# Altium project gan_power_vsi.PrjPcb
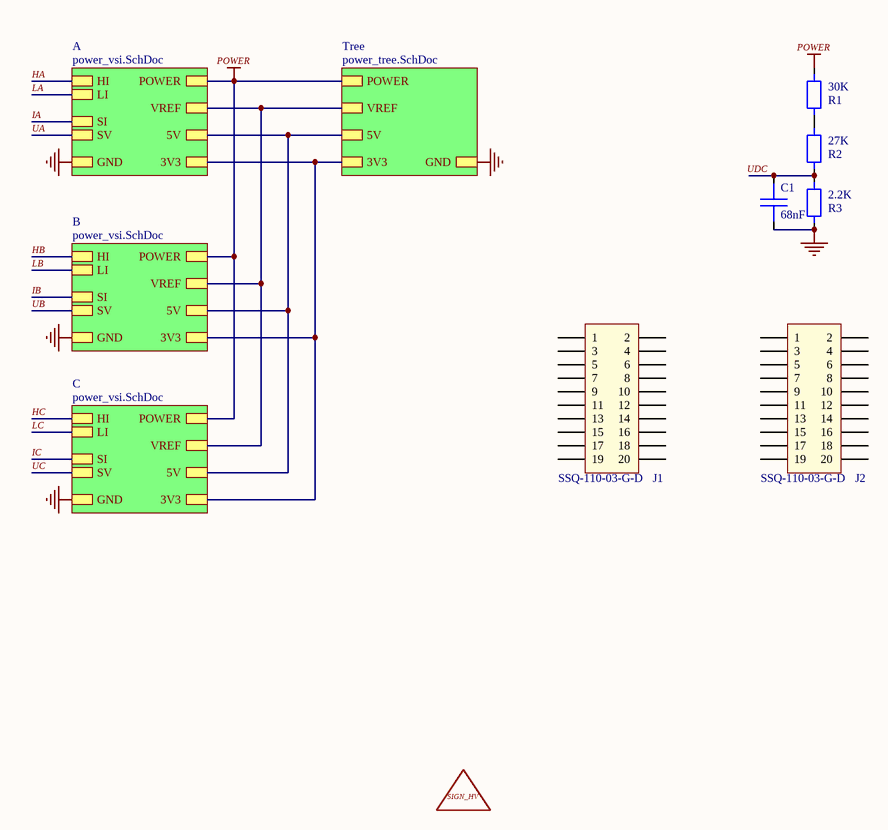
[diagram p0: power_full.SchDoc]
3 sheets, 184 parts. Net scope: hierarchical (ports join the sheet entries above them; power ports are global).
Board file: power_pcb.PcbDoc
Sheets:
  power_full.SchDoc
    A = power_vsi.SchDoc
    Tree = power_tree.SchDoc
    B = power_vsi.SchDoc
    C = power_vsi.SchDoc

## Sheet power_full.SchDoc
size A4; SheetNumber: 1; SheetTotal: 3

### Parts
C1  68nF  [C0402]
J1  SSQ-110-03-G-D  [HDR-TH_P2.5_20P-Stacking]
J2  SSQ-110-03-G-D  [HDR-TH_P2.5_20P-Stacking]
R1  30K  [R0402]
R2  27K  [R0402]
R3  2.2K  [R0402]
S1  SIGN_HV  [SIGN_HV]  (value not drawn)  (no BOM)

### Sub-sheets
A = power_vsi.SchDoc: HI, LI, SI, POWER, GND, SV, 5V, 3V3, VREF
B = power_vsi.SchDoc: HI, LI, SI, POWER, GND, SV, 5V, 3V3, VREF
C = power_vsi.SchDoc: HI, LI, SI, POWER, GND, SV, 5V, 3V3, VREF
Tree = power_tree.SchDoc: POWER, GND, 5V, 3V3, VREF

### Nets
3V3: sheet A/3V3, sheet Tree/3V3, sheet B/3V3, sheet C/3V3
5V: sheet A/5V, sheet Tree/5V, sheet B/5V, sheet C/5V
GND: C1.2 R3.2 ; sheet A/GND, sheet Tree/GND, sheet B/GND, sheet C/GND
POWER: R1.1 ; sheet A/POWER, sheet Tree/POWER, sheet B/POWER, sheet C/POWER
NetC1_1: C1.1 R2.2 R3.1
NetC15_2: sheet A/VREF, sheet Tree/VREF, sheet B/VREF, sheet C/VREF
NetR1_2: R1.2 R2.1

Not connected (* = marked no-connect by the designer): J1 10(1) 11(2) 12(3) 13(4) 14(5) 15(6) 16(7) 17(8) 18(9) 19(10) 20(11) 21(12) 22(13) 23(14) 24(15) 25(16) 26(17) 27(18) 28(19) 29(20); J2 10(1) 11(2) 12(3) 13(4) 14(5) 15(6) 16(7) 17(8) 18(9) 19(10) 20(11) 21(12) 22(13) 23(14) 24(15) 25(16) 26(17) 27(18) 28(19) 29(20)

### Notes on the sheet
- Labels drawn without touching a wire or pin: UDC

### Library data of the parts
C1 = Capacitor: 16V, 5%
J1 J2 = TH-20P
R1-R3 = Resistance: 1%

## Sheet power_vsi.SchDoc
size A4; SheetNumber: 3; SheetTotal: 3
Used 3 times, as channels A, B, C. Parts and nets are listed once, with the designators drawn on the sheet.
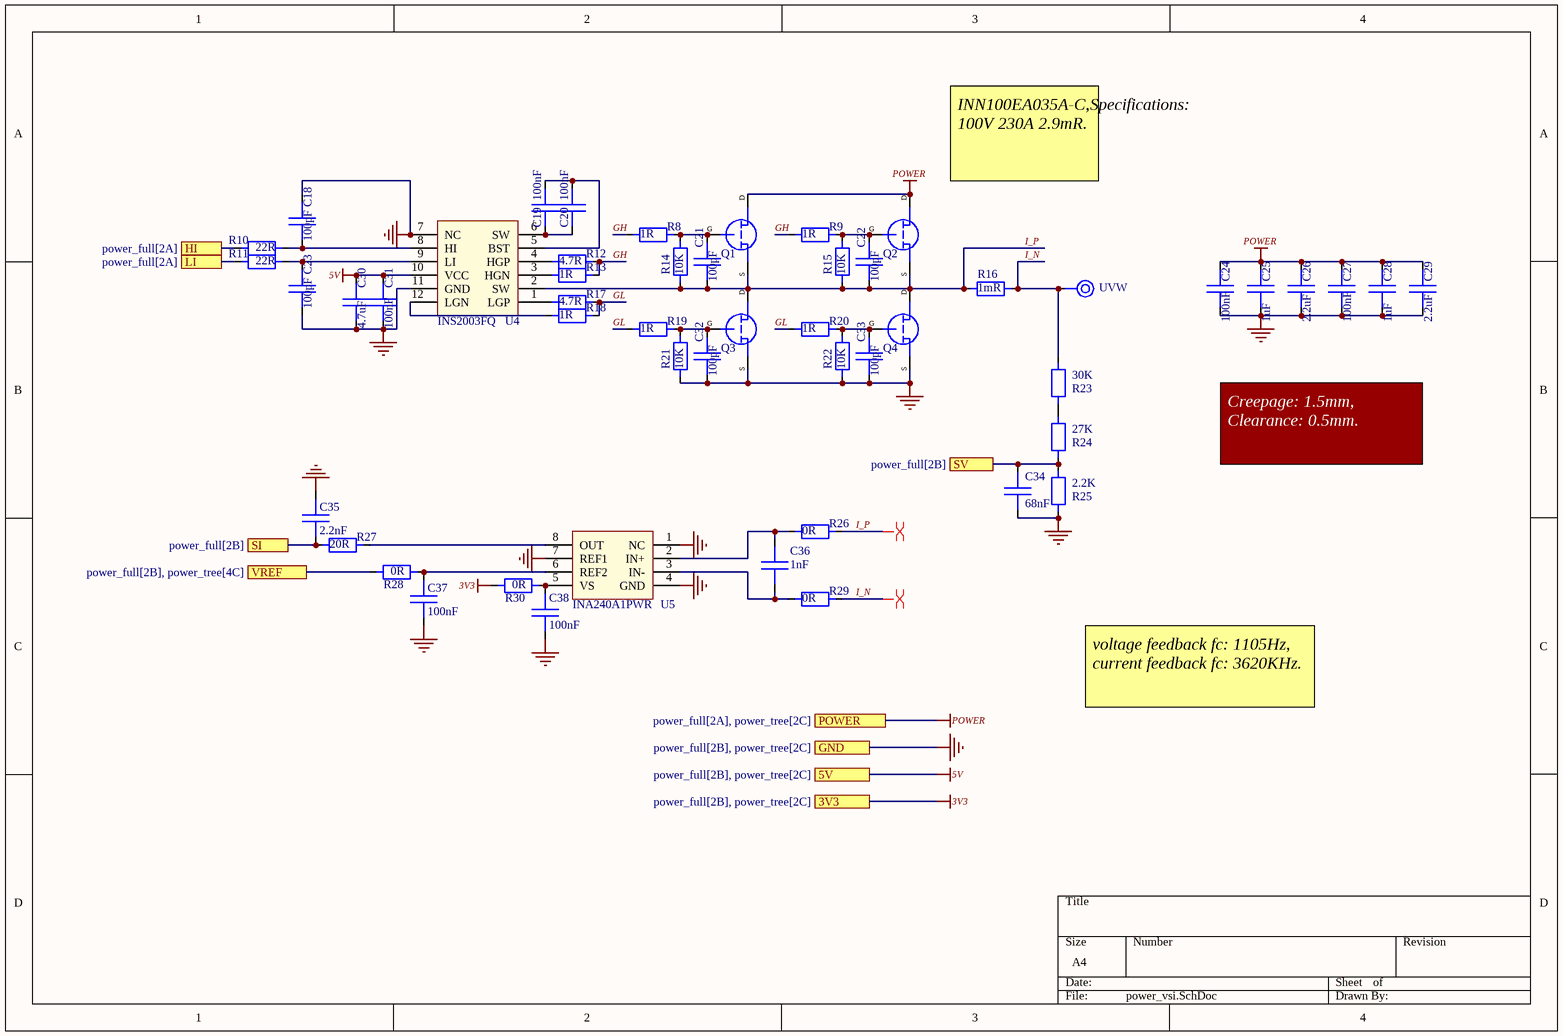
[diagram p1: power_vsi.SchDoc]

### Parts
C18  100pF  [C0402]
C19  100nF  [C0402]
C20  100nF  [C0402]
C21  100pF  [C0402]
C22  100pF  [C0402]
C23  100pF  [C0402]
C24  100nF  [C0805]
C25  1uF  [C0805]
C26  2.2uF  [C0805]
C27  100nF  [C0805]
C28  1uF  [C0805]
C29  2.2uF  [C0805]
C30  4.7uF  [C0402]
C31  100nF  [C0402]
C32  100pF  [C0402]
C33  100pF  [C0402]
C34  68nF  [C0402]
C35  2.2nF  [C0402]
C36  1nF  [C0402]
C37  100nF  [C0402]
C38  100nF  [C0402]
Mp1  UVW  [M2.5-S]
Q1  INN100EA035A  [En-FCLGA9]  (value not drawn)
Q2  INN100EA035A  [En-FCLGA9]  (value not drawn)
Q3  INN100EA035A  [En-FCLGA9]  (value not drawn)
Q4  INN100EA035A  [En-FCLGA9]  (value not drawn)
R8  1R  [R0402]
R9  1R  [R0402]
R10  22R  [R0402]
R11  22R  [R0402]
R12  4.7R  [R0402]
R13  1R  [R0402]
R14  10K  [R0402]
R15  10K  [R0402]
R16  1mR  [R2512]
R17  4.7R  [R0402]
R18  1R  [R0402]
R19  1R  [R0402]
R20  1R  [R0402]
R21  10K  [R0402]
R22  10K  [R0402]
R23  30K  [R0402]
R24  27K  [R0402]
R25  2.2K  [R0402]
R26  0R  [R0402]
R27  20R  [R0402]
R28  0R  [R0402]
R29  0R  [R0402]
R30  0R  [R0402]
U4  INS2003FQ  [QFN12]
U5  INA240A1PWR  [TSSOP8]

### Ports
3V3 (see power_full[2B], power_tree[2C]), 5V (see power_full[2B], power_tree[2C]), GND (see power_full[2B], power_tree[2C]), HI (see power_full[2A]), LI (see power_full[2A]), POWER (see power_full[2A], power_tree[2C]), SI (see power_full[2B]), SV (see power_full[2B]), VREF (see power_full[2B], power_tree[4C])

### Nets
3V3: R30.1 ; port 3V3
5V: C30.2 C31.1 U4.10(VCC) ; port 5V
GND: C18.2 C23.1 C24.1 C25.1 C26.1 C27.1 C28.1 C29.1 C30.1 C31.2 C32.1 C33.1 C34.2 C35.2 C37.1 C38.1 Q3.S Q4.S R21.1 R22.1 R25.2 U4.7(NC) U4.11(GND) U5.1(NC) U5.4(GND) U5.7(REF1) ; port GND
POWER: C24.2 C25.2 C26.2 C27.2 C28.2 C29.2 Q1.D Q2.D ; port POWER
GH: R8.2 R9.2 R12.1 R13.1
GL: R17.1 R18.1 R19.2 R20.2
HI: R10.1 ; port HI
I_N: Mp1.1 R16.1 R23.1 R29.1
I_P: C21.1 C22.1 Q1.S Q2.S Q3.D Q4.D R14.1 R15.1 R16.2 R26.1 U4.2(SW)
LI: R11.1 ; port LI
SI: C35.1 R27.2 ; port SI
SV: C34.1 R24.2 R25.1 ; port SV
VREF: R28.1 ; port VREF
NetC18_1: C18.1 R10.2 U4.8(HI)
NetC19_1: C19.1 C20.1 U4.5(BST)
NetC19_2: C19.2 C20.2 U4.6(SW)
NetC21_2: C21.2 Q1.G R8.1 R14.2
NetC22_2: C22.2 Q2.G R9.1 R15.2
NetC23_2: C23.2 R11.2 U4.9(LI)
NetC32_2: C32.2 Q3.G R19.1 R21.2
NetC33_2: C33.2 Q4.G R20.1 R22.2
NetC36_1: C36.1 R26.2 U5.2(IN+)
NetC36_2: C36.2 R29.2 U5.3(IN-)
NetC37_2: C37.2 R28.2 U5.6(REF2)
NetC38_2: C38.2 R30.2 U5.5(VS)
NetR12_2: R12.2 U4.4(HGP)
NetR13_2: R13.2 U4.3(HGN)
NetR17_2: R17.2 U4.1(LGP)
NetR18_2: R18.2 U4.12(LGN)
NetR23_2: R23.2 R24.1
NetR27_1: R27.1 U5.8(OUT)

### Channels
A: designators end in _A; ports 3V3=3V3 5V=5V GND=GND HI=HA LI=LA POWER=POWER SI=IA SV=UA VREF=NetC15_2
B: designators end in _B; ports 3V3=3V3 5V=5V GND=GND HI=HB LI=LB POWER=POWER SI=IB SV=UB VREF=NetC15_2
C: designators end in _C; ports 3V3=3V3 5V=5V GND=GND HI=HC LI=LC POWER=POWER SI=IC SV=UC VREF=NetC15_2

### Layout directives
differential pair: I_N_A, I_P_A

### Notes on the sheet
- (near Q2) INN100EA035A-C,Specifications:  100V 230A 2.9mR.
- Creepage: 1.5mm, Clearance: 0.5mm.
- voltage feedback fc: 1105Hz, current feedback fc: 3620KHz.

### Library data of the parts
C18 C23 C30 C31 C37 C38 = Capacitor: 16V, 10%
C19 C20 = Capacitor: 25V, 5%
C21 C22 C32-C36 = Capacitor: 16V, 5%
C24-C29 = Capacitor: 100V 10%
Mp1 = Mpad
Q1-Q4 = GaN
R8 R9 R12-R15 R17-R22 R27 = Resistance: 5%
R10 R11 = Resistance: 10%
R16 R23-R25 R30 = Resistance: 1%
R26 R28 R29 = Resistance
U4 = INS200xFQ
U5 = INA240AxPWR

## Sheet power_tree.SchDoc
size A4; SheetNumber: 2; SheetTotal: 3
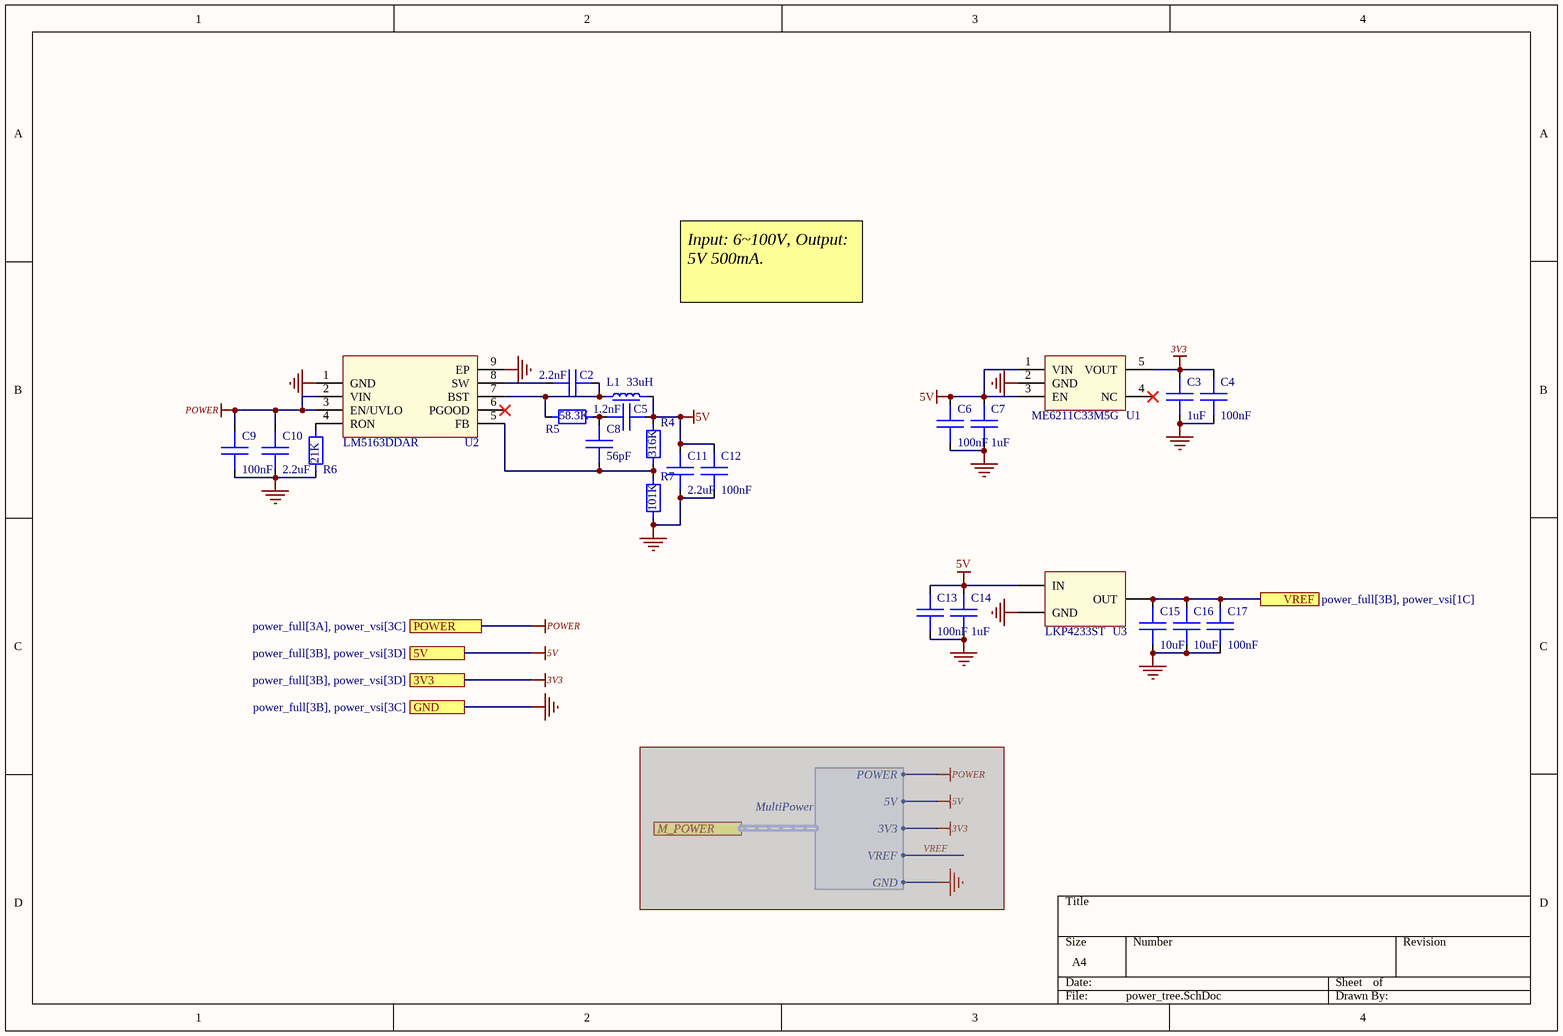
[diagram p2: power_tree.SchDoc]

### Parts
C2  2.2nF  [C0603]
C3  1uF  [C0402]
C4  100nF  [C0402]
C5  1.2nF  [C0603]
C6  100nF  [C0402]
C7  1uF  [C0402]
C8  56pF  [C0603]
C9  100nF  [C0603]
C10  2.2uF  [C1206]
C11  2.2uF  [C0603]
C12  100nF  [C0603]
C13  100nF  [C0402]
C14  1uF  [C0402]
C15  10uF  [C0402]
C16  10uF  [C0402]
C17  100nF  [C0402]
L1  33uH  [IND-SMD6028]
R4  316K  [R0603]
R5  58.3K  [R0603]
R6  21K  [R0603]
R7  101K  [R0603]
U1  ME6211C33M5G  [SOT23-5]
U2  LM5163DDAR  [SOIC8-EP]
U3  LKP4233ST  [SOT23-3]

### Ports
3V3 (see power_full[3B], power_vsi[3D]), 5V (see power_full[3B], power_vsi[3D]), GND (see power_full[3B], power_vsi[3C]), M_POWER (harness MultiPower), POWER (see power_full[3A], power_vsi[3C]), VREF (see power_full[3B], power_vsi[1C])

### Harnesses
MultiPower: POWER, 5V, 3V3, VREF, GND

### Nets
3V3: C3.2 C4.2 U1.5(VOUT) ; port 3V3
5V: C5.1 C6.2 C7.2 C11.2 C12.2 C13.2 C14.2 L1.2 R4.2 U1.1(VIN) U1.3(EN) U3.1(IN) ; port 5V
GND: C3.1 C4.1 C6.1 C7.1 C9.1 C10.1 C11.1 C12.1 C13.1 C14.1 C15.1 C16.1 C17.1 R6.1 R7.1 U1.2(GND) U2.1(GND) U2.9(EP) U3.3(GND) ; port GND
POWER: C9.2 C10.2 U2.2(VIN) U2.3(EN/UVLO) ; port POWER
NetC2_1: C2.1 L1.1 R5.2 U2.7(BST)
NetC2_2: C2.2 U2.8(SW)
NetC5_2: C5.2 C8.2 R5.1
NetC8_1: C8.1 R4.1 R7.2 U2.5(FB)
NetC15_2: C15.2 C16.2 C17.2 U3.2(OUT) ; port VREF
NetR6_2: R6.2 U2.4(RON)

Not connected (* = marked no-connect by the designer): U1 4(NC)*; U2 6(PGOOD)*

### Notes on the sheet
- Input: 6~100V, Output: 5V 500mA.

### Library data of the parts
C2 C5 C8 = Capacitor: 50V 5%
C3 C4 C6 C7 C11-C14 C17 = Capacitor: 16V 10%
C9 C10 = Capacitor: 100V 10%
C15 C16 = Capacitor: 10V 10%
L1 = Inductor
R4 R6 R7 = Resistance: 1%
R5 = Resistance: 5%
U2 = LM516xDDAR
U3 = LKP42xxST

## Nets that join several sheets
3V3: A (R30_A.1), power_tree (C3.2 C4.2 U1.5), B (R30_B.1), C (R30_C.1)
5V: A (C30_A.2 C31_A.1 U4_A.10), power_tree (12 pins), B (C30_B.2 C31_B.1 U4_B.10), C (C30_C.2 C31_C.1 U4_C.10)
GND: power_full (C1.2 R3.2), A (26 pins), power_tree (19 pins), B (26 pins), C (26 pins)
POWER: power_full (R1.1), A (8 pins), power_tree (C9.2 C10.2 U2.2 U2.3), B (8 pins), C (8 pins)
NetC15_2: A (R28_A.1), power_tree (C15.2 C16.2 C17.2 U3.2), B (R28_B.1), C (R28_C.1)